# Altium schematic sheet Power.SchDoc
size A4; SheetNumber: 4; SheetTotal: 4
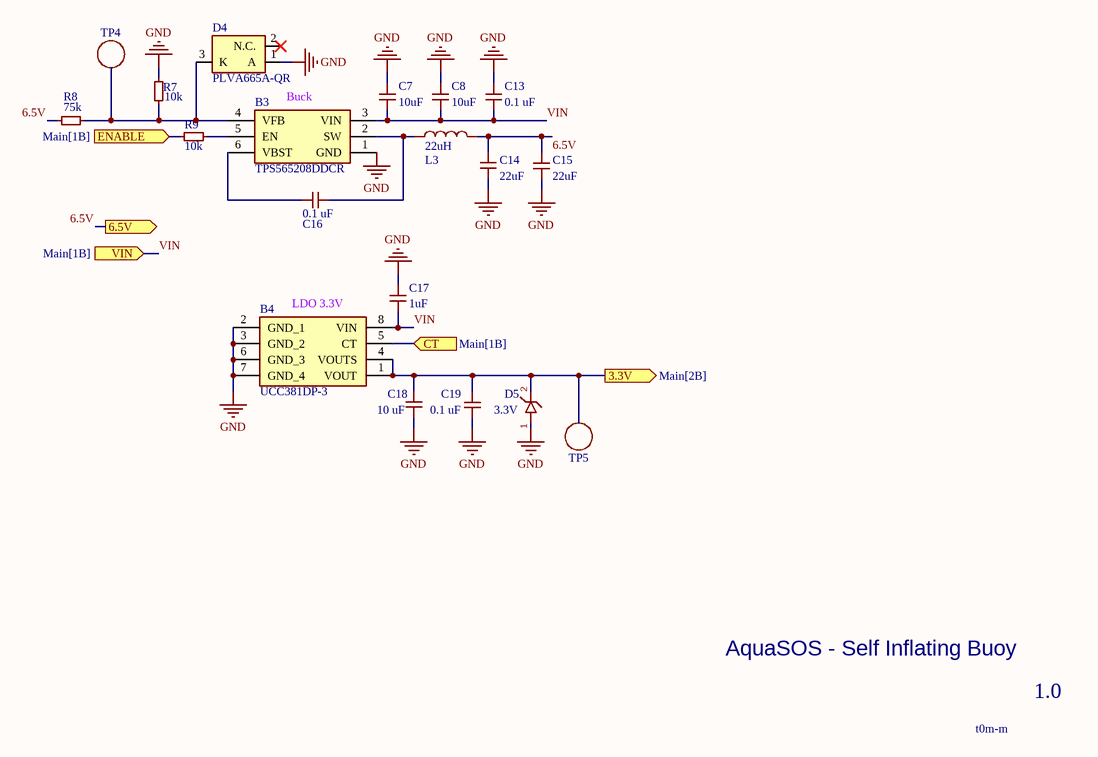
[diagram p0: Power.SchDoc]

## Parts
B3  TPS565208DDCR  [SOT95P280X110-6N]
B4  UCC381DP-3  [UCC381DP-3-8N]
C7  10uF  [CAPC2012X145N]
C8  10uF  [CAPC2012X145N]
C13  0.1 uF  [MLASU105SB7104KFNB25]
C14  22uF  [CL31X226KPHN3NE]
C15  22uF  [CL31X226KPHN3NE]
C16  0.1 uF  [MLASU105SB7104KFNB25]
C17  1uF  [MLASU105SB7104KFNB25]
C18  10 uF  [KGM05CS60J106MH]
C19  0.1 uF  [MLASU105SB7104KFNB25]
D4  PLVA665A-QR  [PLVA665A-QR]
D5  3.3V  [MMSZ5226C-HE3_A-08]
L3  22uH  [SRR1240-3R3Y]
R7  10k  [CRCW040210K0FKEDC]
R8  75k  [CRCW040210K0FKEDC]
R9  10k  [CRCW040210K0FKEDC]
TP4  TP  [Test Point]  (value not drawn)  (no BOM)
TP5  TP  [Test Point]  (value not drawn)  (no BOM)

## Ports
3.3V (out, see Main[2B]), 6.5V (out, see Main[2B]), CT (in, see Main[1B]), ENABLE (in, see Main[1B]), VIN (in, see Main[1B])

## Nets
GND: B3.1(GND) B4.2(GND_1) B4.3(GND_2) B4.6(GND_3) B4.7(GND_4) C7.2 C8.2 C13.1 C14.2 C15.2 C17.1 C18.2 C19.2 D4.1(A) D5.1(K) R7.1
3.3V: B4.1(VOUT) B4.4(VOUTS) C18.1 C19.1 D5.2(A) TP5.1 ; port 3.3V
6.5V: C14.1 C15.1 L3.2 R8.1 ; port 6.5V
CT: B4.5(CT) ; port CT
ENABLE: R9.1 ; port ENABLE
VIN: B3.3(VIN) B4.8(VIN) C7.1 C8.1 C13.2 C17.2 ; port VIN
NetB3_2: B3.2(SW) C16.2 L3.1
NetB3_4: B3.4(VFB) D4.3(K) R7.2 R8.2 TP4.1
NetB3_5: B3.5(EN) R9.2
NetB3_6: B3.6(VBST) C16.1

Not connected (* = marked no-connect by the designer): D4 2(N.C.)*

## Notes on the sheet
- (near B3) Buck
- (near B4) LDO 3.3V
- AquaSOS - Self Inflating Buoy
- 1.0
- t0m-m

## Library data of the parts
B3 = TPS565208DDCR: 4.5V to 17V, 5A Synchronous Step-Down Voltage Regulator in SOT23; Manufacturer_Name: Texas Instruments; Geometry.Height: 1.1mm; Mouser Part Number: 595-TPS565208DDCR; Mouser Price/Stock: https://www.mouser.co.uk/ProductDetail/Texas-Instruments/TPS565208DDCR?qs=YCa%2FAAYMW00vylGjeU1iOg%3D%3D; Manufacturer_Part_Number: TPS565208DDCR; Datasheet Link: http://www.ti.com/lit/gpn/tps565208
B4 = UCC381DP-3: 1-A, Low-Dropout Linear Regulator; Manufacturer_Name: Texas Instruments; Geometry.Height: 1.75mm; Mouser Part Number: 595-UCC381DP-3; Mouser Price/Stock: https://www.mouser.co.uk/ProductDetail/Texas-Instruments/UCC381DP-3?qs=zqbRmZ%252BfZD%2FJDJYUm2bEUA%3D%3D; Manufacturer_Part_Number: UCC381DP-3; Datasheet Link: http://www.ti.com/lit/gpn/ucc381
C7 C8 = C0805X106K8RACAUTO7210
C13 C16 C19 = MLASU105SB7104KFNB25: 0.1uF Capacitor
C14 C15 = CL31X226KPHN3NE: CAP CER 22UF 10V X6S 1206
C17 = GRM155Z71A105KE01D: 1uF 0402 10V
C18 = KGM05CS60J106MH: 10 uF Capacitor
D4 = PLVA665A-QR: Zener Diode 6.5 V 250 mW +/-3.08% Surface Mount TO-236AB; Manufacturer_Name: Nexperia; Geometry.Height: 1.1mm; Mouser Part Number: 771-PLVA665A-QR; Mouser Price/Stock: https://www.mouser.co.uk/ProductDetail/Nexperia/PLVA665A-QR?qs=Wj%2FVkw3K%252BMC5ajF4QI9XNg%3D%3D; Manufacturer_Part_Number: PLVA665A-QR; Datasheet Link: https://assets.nexperia.com/documents/data-sheet/PLVA6XXA-Q_SER.pdf
D5 = MMSZ5226C-HE3_A-08: 3.3V Zener Diode
L3 = SRR1240-3R3Y
R7 R9 = CRCW040210K0FKEDC: 10k 0402 Resistor
R8 = RT73F1E75KBTH
TP4 TP5 = Test Point